# EAGLE design reefingBrd (EAGLE 9.6.2)
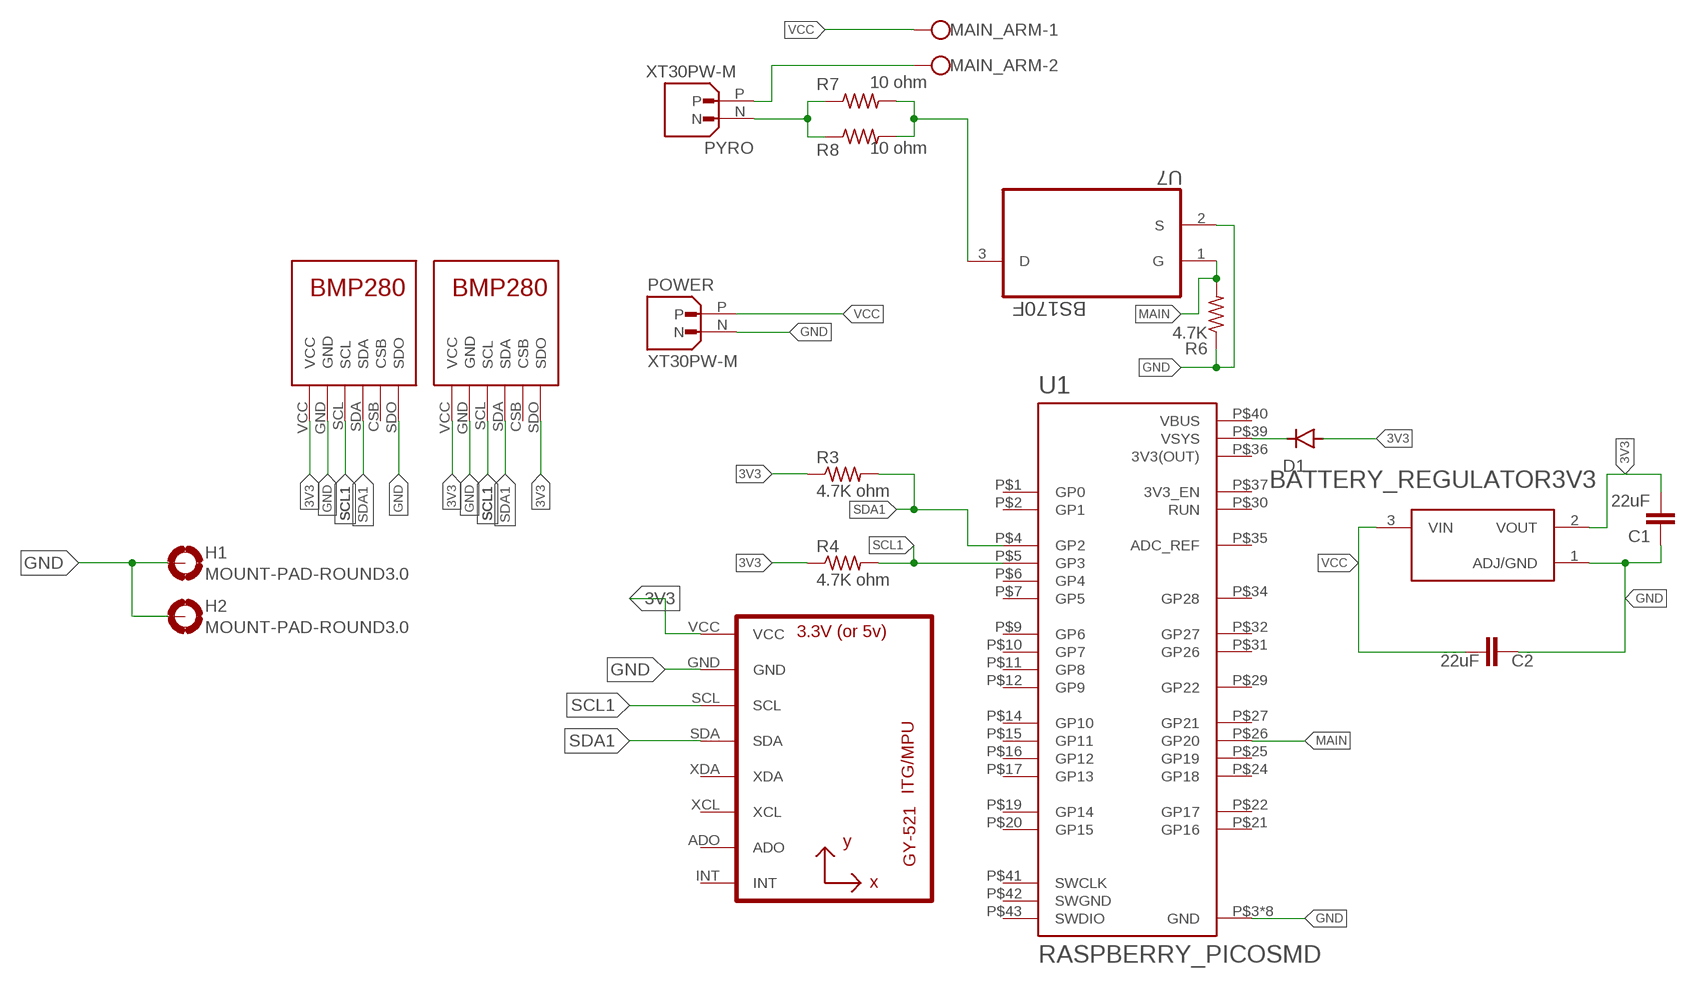
[diagram p0: schematic, sheet 1]

## Parts
BATTERY_REGULATOR3V3  AMS1117-3.3  [SOT229P700X180-4N]
C1  22uF  22UF-0805-6.3V-20%  [0805]
C2  22uF  22UF-0805-6.3V-20%  [0805]
D1  1N4004  [DO41-10]
H1  MOUNT-PAD-ROUND3.0  [3,0-PAD]
H2  MOUNT-PAD-ROUND3.0  [3,0-PAD]
MAIN_ARM  W237-102  [W237-102]
POWER  XT30PW-M  [AMASS_XT30PW-M]
PYRO  XT30PW-M  [AMASS_XT30PW-M]
R3  4.7K ohm  R-US_R0805  [R0805]
R4  4.7K ohm  R-US_R0805  [R0805]
R6  4.7K  R-US_R0805  [R0805]
R7  10 ohm  R-US_0207/10  [0207/10]
R8  10 ohm  R-US_0207/10  [0207/10]
U1  RASPBERRY_PICOSMD  [PICO-PKG-SMD]
U2  GY-521MPU6050  [GY-521]
U7  BS170F  [SOT91P240X120-3N]
U$1  BMP280  [BMP280]
U$2  BMP280  [BMP280]

## Nets
3V3: BATTERY_REGULATOR3V3.2(VOUT) C1.2 D1.A R3.1 R4.1 U2.VCC U$1.VCC U$2.SDO U$2.VCC
GND: BATTERY_REGULATOR3V3.1(ADJ/GND) C1.1 C2.1 H1.B3,0(MOUNT) H2.B3,0(MOUNT) POWER.N R6.1 U1.P$3(GND) U1.P$8(GND) U1.P$13(GND) U1.P$18(GND) U1.P$23(GND) U1.P$28(GND) U1.P$33(GND) U1.P$38(GND) U2.GND U7.2(S) U$1.GND U$1.SDO U$2.GND
MAIN: R6.2 U1.P$26(GP20) U7.1(G)
N$1: D1.C U1.P$39(VSYS)
N$4: PYRO.N R7.1 R8.1
N$5: R7.2 R8.2 U7.3(D)
N$6: MAIN_ARM.2 PYRO.P
SCL1: R4.2 U1.P$5(GP3) U2.SCL U$1.SCL U$2.SCL
SDA1: R3.2 U1.P$4(GP2) U2.SDA U$1.SDA U$2.SDA
VCC: BATTERY_REGULATOR3V3.3(VIN) C2.2 MAIN_ARM.1 POWER.P
Unconnected: U1.P$1(GP0) U1.P$2(GP1) U1.P$6(GP4) U1.P$7(GP5) U1.P$9(GP6) U1.P$10(GP7) U1.P$11(GP8) U1.P$12(GP9) U1.P$14(GP10) U1.P$15(GP11) U1.P$16(GP12) U1.P$17(GP13) U1.P$19(GP14) U1.P$20(GP15) U1.P$21(GP16) U1.P$22(GP17) U1.P$24(GP18) U1.P$25(GP19) U1.P$27(GP21) U1.P$29(GP22) U1.P$30(RUN) U1.P$31(GP26) U1.P$32(GP27) U1.P$34(GP28) U1.P$35(ADC_REF) U1.P$37(3V3_EN) U1.P$41(SWCLK) U1.P$43(SWDIO) U2.ADO U2.INT U2.XCL U2.XDA U$1.CSB U$2.CSB

## Power pins joined to a net without a drawn wire
3V3(OUT): U1.P$36(3V3(OUT))
SWGND: U1.P$42(SWGND)
VBUS: U1.P$40(VBUS)

## Library data of the parts
BATTERY_REGULATOR3V3 = AMS1117-3.3:AMS1117-3.3: Sot223/Pkg 1-Amp 3.3-Volt Low Drop Out Voltage Regulatator Check availability <https://pricing.snapeda.com/parts/AMS1117-3.3/Advanced%20Monolithic%20Systems/view-part?ref=eda>; AVAILABILITY: Not in stock; DESCRIPTION: Sot223/Pkg 1-Amp 3.3-Volt Low Drop Out Voltage Regulatator; MF: Advanced Monolithic Systems; MP: AMS1117-3.3; PACKAGE: SOT-223 Seeed Technology; PRICE: None
C1 C2 = SparkFun-Capacitors:22UF: 22µF ceramic capacitors A capacitor is a passive two-terminal electrical component used to store electrical energy temporarily in an electric field.; PROD_ID: CAP-08402
D1 = diode:1N4004: DIODE general purpose rectifier, 1 A
H1 H2 = holes:MOUNT-PAD-ROUND: MOUNTING PAD, round
MAIN_ARM = con-wago-500:W237-102: WAGO SCREW CLAMP; MPN: 237-102; OC_FARNELL: unknown; OC_NEWARK: 70K9898
POWER PYRO = XT30PW-M:XT30PW-M: Check availability <https://pricing.snapeda.com/parts/XT30PW-M/AMASS/view-part?ref=eda>; AVAILABILITY: Not in stock; CHECK_PRICES: https://www.snapeda.com/parts/XT30PW-M/AMASS/view-part/?ref=eda; DESCRIPTION: Socket; DC supply; XT30; male; PIN: 2; on PCBs; THT; Colour: yellow; MF: AMASS; MP: XT30PW-M; PACKAGE: None; PRICE: None; SNAPEDA_LINK: https://www.snapeda.com/parts/XT30PW-M/AMASS/view-part/?ref=snap
R3 R4 R6-R8 = rcl:R-US_: RESISTOR, American symbol; SPICEPREFIX: R
U1 = RpiPico:RASPBERRY_PICO: Raspberry Pi Pico
U2 = gy-521:GY-521
U7 = BS170F:BS170F: DMOS FET Check availability <https://pricing.snapeda.com/parts/BS170F/Diodes%20Inc./view-part?ref=eda>; AVAILABILITY: In Stock; CHECK_PRICES: https://www.snapeda.com/parts/BS170F/Diodes+Inc./view-part/?ref=eda; DESCRIPTION: N-Channel 60 V 150µA (Ta) 330mW (Ta) Surface Mount SOT-23-3; MF: Diodes Inc.; MP: BS170F; PACKAGE: SOT-23 Multicomp; PRICE: None; SNAPEDA_LINK: https://www.snapeda.com/parts/BS170F/Diodes+Inc./view-part/?ref=snap
U$1 U$2 = BMP280:BMP280

## Board
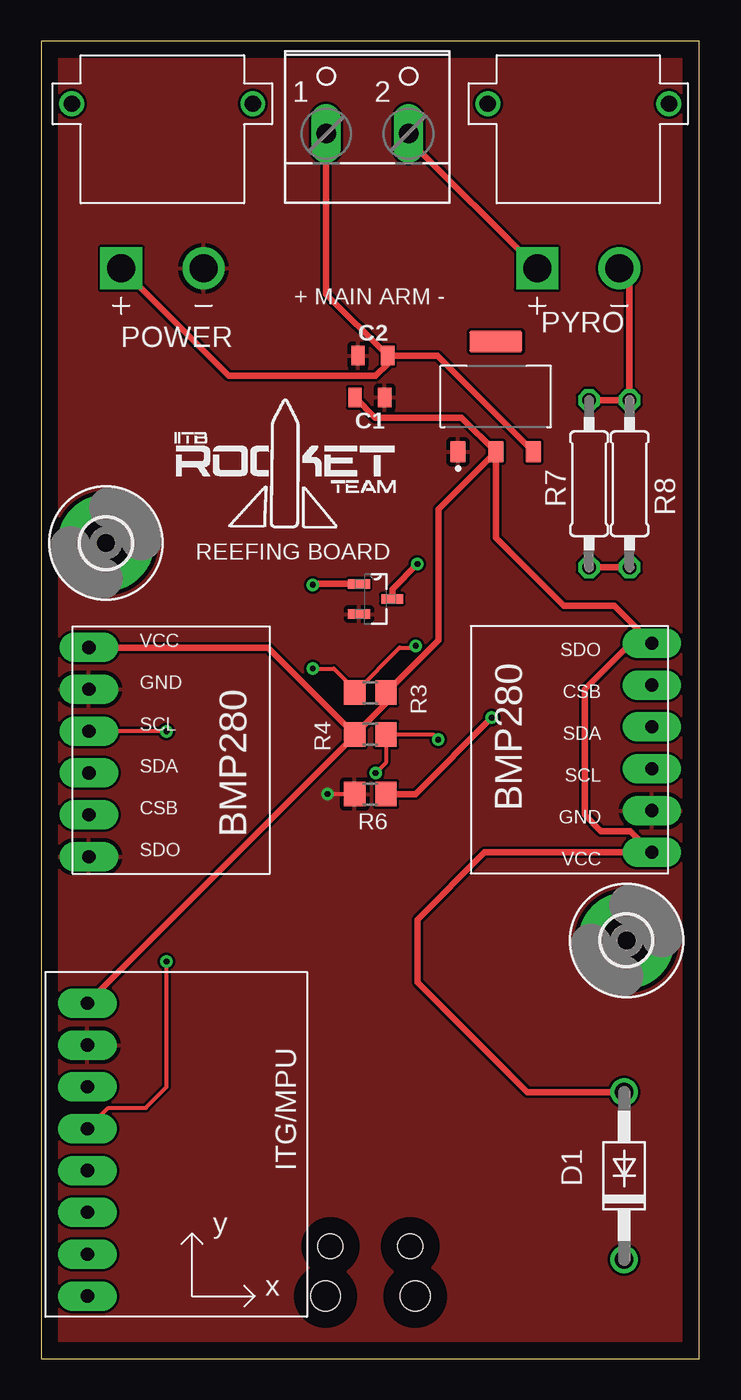
[diagram p1: board, top side]
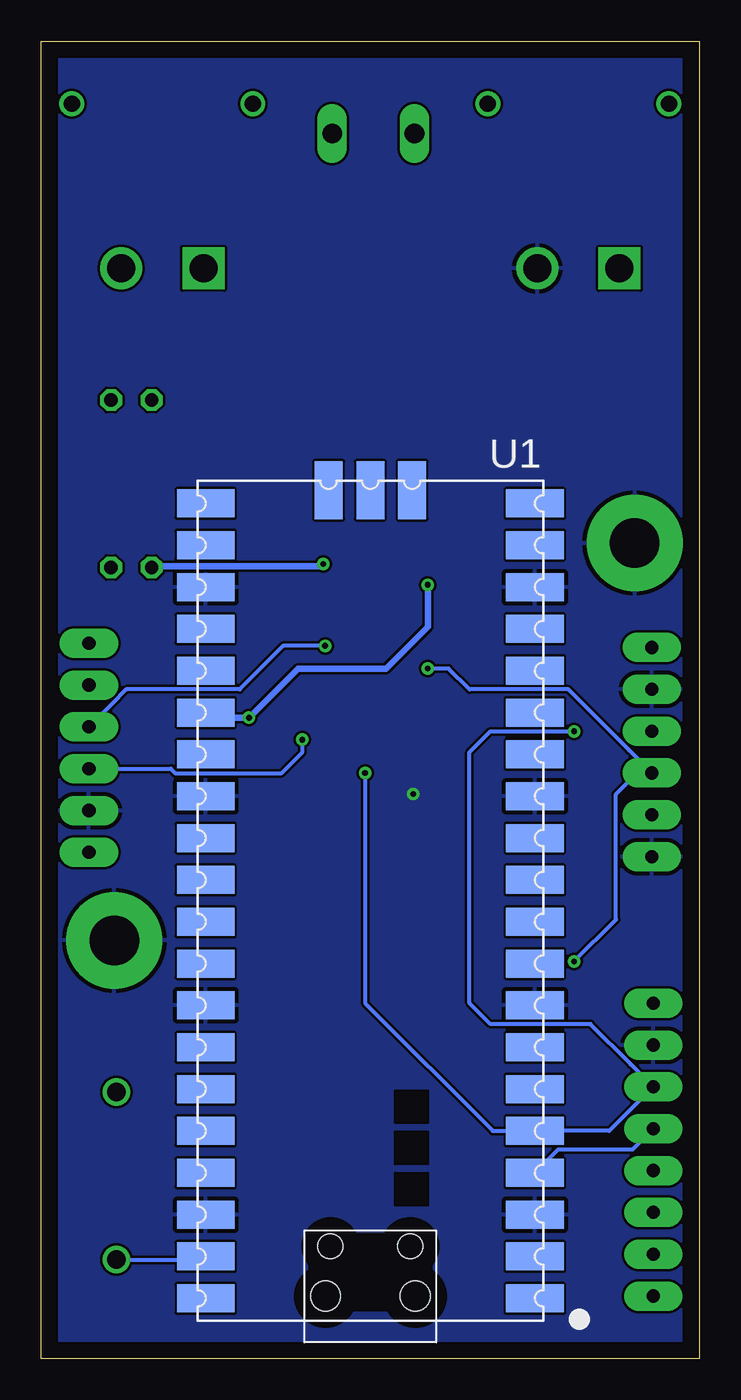
[diagram p2: board, bottom side, seen from below]

Size 40 x 80 mm. Coordinates in mm from the lower left corner, seen from the top.
Outline: 0,0 40,0 40,80 0,80 0,0
Copper layers (1*16): Top 0.035mm / dielectric 1.5mm / Bottom 0.035mm
Design rules "default": minimum track width 6mil, minimum drill 0.35mm, track to track 6mil, track to pad 6mil, pad to pad 6mil, via to via 6mil, smd to smd 6mil, copper to edge 40mil, drill to drill 6mil, minimum pad ring 10mil, minimum via ring 8mil, stop-mask expansion 4mil, vias tented up to drill 0mil, thermal gap 10mil

### Footprints (pad centres in the part's own frame; a part is rotated, then mirrored left to right if it is on the bottom)
SOT229P700X180-4N = smd 0.93 x 1.31: 1 -2.29,-3.345; 2 0,-3.345; 3 2.29,-3.345 | smd 3.24 x 1.31: 4 0,3.345
0805 = smd 0.8 x 1.2: 1 -0.9,0; 2 0.9,0
DO41-10 = drill 1.118: A 5.08,0; C -5.08,0
3,0-PAD = drill 3 pad 5.842: B3,0 0,0
W237-102 = drill 1.194 long: 1 -2.5,-1.27; 2 2.5,-1.27
AMASS_XT30PW-M = drill 1.7: N 2.5,-10 | drill 1.7 square: P -2.5,-10 | drill 1: S1 5.5,0; S2 -5.5,0
R0805 = smd 1.3 x 1.5: 1 -0.95,0; 2 0.95,0
0207/10 = drill 0.813 octagon: 1 -5.08,0; 2 5.08,0
PICO-PKG-SMD = smd 3.5 x 1.7: P$1 -10,24.13; P$2 -10,21.59; P$3 -10,19.05; P$4 -10,16.51; P$5 -10,13.97; P$6 -10,11.43; P$7 -10,8.89; P$8 -10,6.35; P$9 -10,3.81; P$10 -10,1.27; P$11 -10,-1.27; P$12 -10,-3.81; P$13 -10,-6.35; P$14 -10,-8.89; P$15 -10,-11.43; P$16 -10,-13.97; P$17 -10,-16.51; P$18 -10,-19.05; P$19 -10,-21.59; P$20 -10,-24.13; P$21 10,-24.13; P$22 10,-21.59; P$23 10,-19.05; P$24 10,-16.51; P$25 10,-13.97; P$26 10,-11.43; P$27 10,-8.89; P$28 10,-6.35; P$29 10,-3.81; P$30 10,-1.27; P$31 10,1.27; P$32 10,3.81; P$33 10,6.35; P$34 10,8.89; P$35 10,11.43; P$36 10,13.97; P$37 10,16.51; P$38 10,19.05; P$39 10,21.59; P$40 10,24.13 | smd 1.7 x 3.5: P$41 -2.54,-24.925; P$42 0,-24.925; P$43 2.54,-24.925 | hole 1.8: -2.725,24; 2.725,24 | hole 1.5: -2.425,20.97; 2.425,20.97
GY-521 = drill 0.8 pad 1.778 long: ADO -8.89,-6.35; GND -8.89,6.35; INT -8.89,-8.89; SCL -8.89,3.81; SDA -8.89,1.27; VCC -8.89,8.89; XCL -8.89,-3.81; XDA -8.89,-1.27
SOT91P240X120-3N = smd 1.321 x 0.559: 1 -1.016,0.914; 2 -1.016,-0.914; 3 1.016,0
BMP280 = drill 0.8 pad 1.778 long: CSB 11.43,1; GND 3.81,1; SCL 6.35,1; SDA 8.89,1; SDO 13.97,1; VCC 1.27,1

### Placement (x,y rotation side)
BATTERY_REGULATOR3V3  27.62,58.42 0 top
C1  19.97,58.37 180 top
C2  20.16,60.91 0 top
D1  35.42,11.11 90 top
H1  35.56,25.4 0 top
H2  3.94,49.53 0 top
MAIN_ARM  19.82,75.66 0 top
POWER  7.37,76.2 0 top
PYRO  32.63,76.2 0 top
R3  20,40.45 180 top
R4  20,37.91 0 top
R6  20,34.29 0 top
R7  33.29,53.13 270 top
R8  35.75,53.13 270 top
U1  20,27.81 180 bottom
U2  11.7,12.7 0 top
U7  20.32,46.13 0 top
U$1  1.9,44.46 270 top
U$2  38.1,29.48 90 top

### Tracks (layer width: path | path; a pad name or v marks a point on that pad's centre or on a via)
3V3
  Top 0.406: U$1.VCC 13.78,43.18 R4.1 | D1.A 29.53,16.19 22.86,22.86 22.86,26.67 26.94,30.75 U$2.VCC 35.8,32.05 33.99,32.05 33.02,33.02 33.02,40.64 35.83,43.45 U$2.SDO 34.83,45.72 31.75,45.72 27.62,49.85 BATTERY_REGULATOR3V3.2 | BATTERY_REGULATOR3V3.2 24.13,51.59 24.13,43.63 R3.1 20.95,39.81 19.94,38.81 19.94,38.8 R4.1 | U2.VCC 19.05,37.83 R4.1 | BATTERY_REGULATOR3V3.2 25.55,57.15 20.29,57.15 C1.2
GND  (via drill 0.35)
  Top 0.254: R6.1 v17.4,34.29
  pour Top: 0.03,79.93 0.03,-0.03 40.03,-0.03 40.03,79.93
  pour Bottom: 0.03,79.65 0.03,0.1 40.01,0.1 40.01,79.65
MAIN  (via drill 0.35)
  Top 0.406: R6.2 22.73,34.29 v27.37,38.92 | v16.51,46.99 16.56,47.04 U7.1
  Bottom 0.406: U1.P$26 29.69,38.92 v27.37,38.92 24.38,41.91 19.05,41.91 16.51,44.45 v16.51,46.99
N$1
  Bottom 0.254: D1.C 30.19,6.03 U1.P$39
N$4
  Top 0.406: PYRO.N 35.75,65.58 R8.1 R7.1
N$5  (via drill 0.35)
  Top 0.406: R8.2 R7.2 | U7.3 21.34,46.74 v22.86,48.26
  Bottom 0.406: v22.86,48.26 22.99,48.13 33.21,48.13 R7.2
N$6
  Top 0.406: MAIN_ARM.2 22.32,74.01 PYRO.P
SCL1  (via drill 0.35)
  Top 0.254: v24.13,37.59 23.81,37.91 R4.2 20.95,36.19 v20.32,35.56 v20.32,35.57 | v7.62,38.1 U$1.SCL
  Bottom 0.254: U$2.SCL 32.13,35.83 31.87,35.57 25.39,35.57 24.13,36.83 v24.13,37.59 | v7.62,38.1 12.7,38.1 13.97,36.83 13.97,21.59 12.7,20.32 6.62,20.32 4.18,17.88 U2.SCL 4.18,15.14 5.49,13.84 U1.P$5 12.57,13.84 20.32,21.59 v20.32,35.57
SDA1  (via drill 0.35)
  Top 0.254: R3.2 19.14,40.55 | 19.14,40.55 21.78,43.18 22.86,43.18 v22.75,43.29 | v16.51,41.91 17.78,41.91 19.14,40.55 | U2.SDA 4.08,15.24 6.35,15.24 7.62,16.51 v7.62,24.13
  Bottom 0.254: U2.SDA 4.08,12.7 8.6,12.7 U1.P$4 | v22.75,43.29 25.29,43.29 27.94,40.64 34.83,40.64 35.73,39.74 U$2.SDA | v16.51,41.91 15.24,41.91 13.97,40.64 7.97,40.64 4.27,36.94 U$1.SDA 3.81,35.56 5.08,34.29 5.08,26.67 v7.62,24.13
VCC
  Top 0.406: POWER.P 11.38,59.69 20.32,59.69 21.06,60.43 C2.2 | BATTERY_REGULATOR3V3.3 24.07,60.91 C2.2 | MAIN_ARM.1 17.32,64.65 C2.2

### Text on the board
tNames: + MAIN ARM - | REEFING BOARD | C:/Users/ASUS/Desktop/FLYTE/Bitmaps/RT logo.bmp